# Altium schematic sheet MCU_STM32L433RCT6.SchDoc
size A4
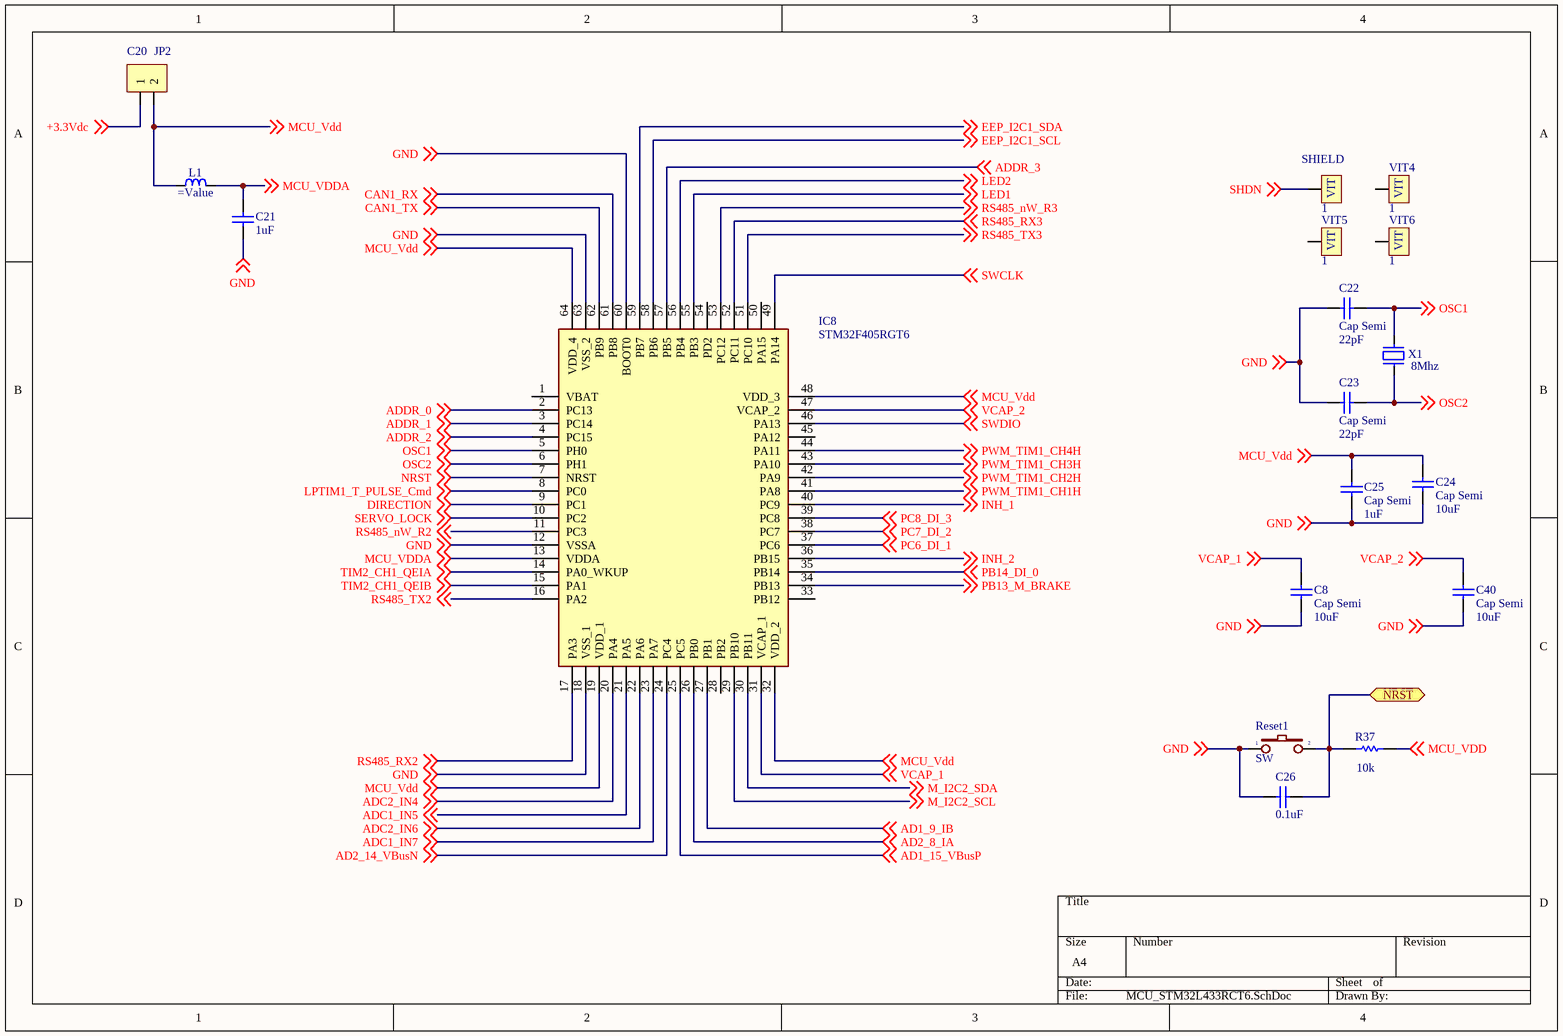
[diagram p0: MCU_STM32L433RCT6.SchDoc]

## Parts
C8  Cap Semi  value 10uF  [CN-SMD-0805]
C20  JP2  [JP2-CLOSED]
C21  1uF  [tu 0805]
C22  Cap Semi  value 22pF  [CN-SMD-0805]
C23  Cap Semi  value 22pF  [CN-SMD-0805]
C24  Cap Semi  value 10uF  [CN-SMD-0805]
C25  Cap Semi  value 1uF  [CN-SMD-0805]
C26  0.1uF  [CN-SMD-0805]
C40  Cap Semi  value 10uF  [CN-SMD-0805]
IC8  STM32F405RGT6  [QFP50P1200X1200X160-64N]
L1  (no value)  [RES 0805]
R37  value 10k  [RES-SMD-0805]  (hidden comment: 0805)
Reset1  SW  [SW1-SMD]
SHIELD  1  [VIT]
VIT4  1  [VIT]
VIT5  1  [VIT]
VIT6  1  [VIT]
X1  8Mhz  [XT2]

## Ports
NRST (bidir)

## Nets
+3.3Vdc: C20.1 ; off-sheet +3.3Vdc
AD1_9_IB: IC8.27(PB1) ; off-sheet AD1_9_IB
AD1_15_VBusP: IC8.25(PC5) ; off-sheet AD1_15_VBusP
AD2_8_IA: IC8.26(PB0) ; off-sheet AD2_8_IA
AD2_14_VBusN: IC8.24(PC4) ; off-sheet AD2_14_VBusN
ADC1_IN5: IC8.21(PA5) ; off-sheet ADC1_IN5
ADC1_IN7: IC8.23(PA7) ; off-sheet ADC1_IN7
ADC2_IN4: IC8.20(PA4) ; off-sheet ADC2_IN4
ADC2_IN6: IC8.22(PA6) ; off-sheet ADC2_IN6
ADDR_0: IC8.2(PC13) ; off-sheet ADDR_0
ADDR_1: IC8.3(PC14) ; off-sheet ADDR_1
ADDR_2: IC8.4(PC15) ; off-sheet ADDR_2
ADDR_3: IC8.57(PB5) ; off-sheet ADDR_3
CAN1_RX: IC8.61(PB8) ; off-sheet CAN1_RX
CAN1_TX: IC8.62(PB9) ; off-sheet CAN1_TX
DIRECTION: IC8.9(PC1) ; off-sheet DIRECTION
EEP_I2C1_SCL: IC8.58(PB6) ; off-sheet EEP_I2C1_SCL
EEP_I2C1_SDA: IC8.59(PB7) ; off-sheet EEP_I2C1_SDA
GND: C8.1 C21.1 C22.1 C23.1 C24.1 C25.1 C26.1 C40.1 IC8.12(VSSA) IC8.18(VSS_1) IC8.60(BOOT0) IC8.63(VSS_2) Reset1.1 ; off-sheet GND
INH_1: IC8.40(PC9) ; off-sheet INH_1
INH_2: IC8.36(PB15) ; off-sheet INH_2
LED1: IC8.55(PB3) ; off-sheet LED1
LED2: IC8.56(PB4) ; off-sheet LED2
LPTIM1_T_PULSE_Cmd: IC8.8(PC0) ; off-sheet LPTIM1_T_PULSE_Cmd
M_I2C2_SCL: IC8.29(PB10) ; off-sheet M_I2C2_SCL
M_I2C2_SDA: IC8.30(PB11) ; off-sheet M_I2C2_SDA
MCU_VDD: C20.2 C24.2 C25.2 IC8.19(VDD_1) IC8.32(VDD_2) IC8.48(VDD_3) IC8.64(VDD_4) L1.1 R37.2 ; off-sheet MCU_VDD, off-sheet MCU_Vdd
MCU_VDDA: C21.2 IC8.13(VDDA) L1.2 ; off-sheet MCU_VDDA
NRST: C26.2 R37.1 Reset1.2 ; port NRST
NRST: IC8.7(NRST) ; off-sheet NRST  [a separate net that carries the same name]
OSC1: C22.2 IC8.5(PH0) X1.1 ; off-sheet OSC1
OSC2: C23.2 IC8.6(PH1) X1.2 ; off-sheet OSC2
PB13_M_BRAKE: IC8.34(PB13) ; off-sheet PB13_M_BRAKE
PB14_DI_0: IC8.35(PB14) ; off-sheet PB14_DI_0
PC6_DI_1: IC8.37(PC6) ; off-sheet PC6_DI_1
PC7_DI_2: IC8.38(PC7) ; off-sheet PC7_DI_2
PC8_DI_3: IC8.39(PC8) ; off-sheet PC8_DI_3
PWM_TIM1_CH1H: IC8.41(PA8) ; off-sheet PWM_TIM1_CH1H
PWM_TIM1_CH2H: IC8.42(PA9) ; off-sheet PWM_TIM1_CH2H
PWM_TIM1_CH3H: IC8.43(PA10) ; off-sheet PWM_TIM1_CH3H
PWM_TIM1_CH4H: IC8.44(PA11) ; off-sheet PWM_TIM1_CH4H
RS485_nW_R2: IC8.11(PC3) ; off-sheet RS485_nW_R2
RS485_nW_R3: IC8.53(PC12) ; off-sheet RS485_nW_R3
RS485_RX2: IC8.17(PA3) ; off-sheet RS485_RX2
RS485_RX3: IC8.52(PC11) ; off-sheet RS485_RX3
RS485_TX2: IC8.16(PA2) ; off-sheet RS485_TX2
RS485_TX3: IC8.51(PC10) ; off-sheet RS485_TX3
SERVO_LOCK: IC8.10(PC2) ; off-sheet SERVO_LOCK
SHDN: SHIELD.VIT1 ; off-sheet SHDN
SWCLK: IC8.49(PA14) ; off-sheet SWCLK
SWDIO: IC8.46(PA13) ; off-sheet SWDIO
TIM2_CH1_QEIA: IC8.14(PA0_WKUP) ; off-sheet TIM2_CH1_QEIA
TIM2_CH1_QEIB: IC8.15(PA1) ; off-sheet TIM2_CH1_QEIB
VCAP_1: C8.2 IC8.31(VCAP_1) ; off-sheet VCAP_1
VCAP_2: C40.2 IC8.47(VCAP_2) ; off-sheet VCAP_2

Not connected (* = marked no-connect by the designer): IC8 1(VBAT) 28(PB2) 33(PB12) 45(PA12) 50(PA15) 54(PD2); VIT4 VIT1(1); VIT5 VIT1(1); VIT6 VIT1(1)

## Library data of the parts
C8 C22-C26 C40 = Cap Semi: Capacitor (Semiconductor SIM Model); Published: 8-Jun-2000; LatestRevisionDate: 29-May-2009; LatestRevisionNote: IPC-7351 Footprint Added.; PackageReference: C1206; Publisher: Altium Limited; PackageDescription: Chip Capacitor
C20 = JP2: WR-PHD 2.54 mm Angled Socket Header; Manufacturer: W¨¹rth Elektronik eiSos GmbH; partNo: 613002143121; ComponentLink1 Description: Manufacturer; ComponentLink2 Description: Datasheet; NoPins: 02; Created Date: 29 March 2013; ComponentLink1URL: http://www.we-online.com; ComponentLink2URL: http://katalog.we-online.de/em/datasheet/6130xx143121.pdf; Created by: Karrer Zheng
C21 = Tu 0805 10pF 50V 10%: Dán; Don_Vi: Con; So_Chan: 2; Ten_Linh_Kien: Tụ 0805 10P 10% 50V; Ma_Hang: MH004554; Chung_Loai: Dán; Kieu_Chan: *
IC8 = STM32F405RGT6: Integrated Circuit; Manufacturer_Name: STMicroelectronics; Datasheet Link: http://www.st.com/web/en/resource/technical/document/datasheet/DM00037051.pdf; Height: 1.6mm; Manufacturer_Part_Number: STM32F405RGT6; Mouser Part Number: 511-STM32F405RGT6; Mouser Price/Stock: https://www.mouser.co.uk/ProductDetail/STMicroelectronics/STM32F405RGT6?qs=Z8%252BeY1k3TIKgj7QWsYGpQw%3D%3D; Arrow Part Number: STM32F405RGT6; Arrow Price/Stock: https://www.arrow.com/en/products/stm32f405rgt6/stmicroelectronics?region=nac
L1 = Inductor
R37 = Res1: Resistor; Published: 8-Jun-2000; LatestRevisionDate: 17-Jul-2002; LatestRevisionNote: Re-released for DXP Platform.; PackageReference: AXIAL-0.3; Publisher: Altium Limited; PackageDescription: Axial Device, Thru-Hole; 2 Leads; 0.3 in Pin Spacing
Reset1 = SW2: Switch button 2 pin; Value: SW chip 2 pin
SHIELD VIT4-VIT6 = VIT: Oc Vit
X1 = XT2: Crystal, 32.768 KHz, -40 to 85 degC, 3.2 x 1.5 x 0.9 mm SMD; Value: 4Mhz